# Altium schematic sheet 03-KSZ9567.SchDoc
size B; SheetNumber: 3; SheetTotal: 10
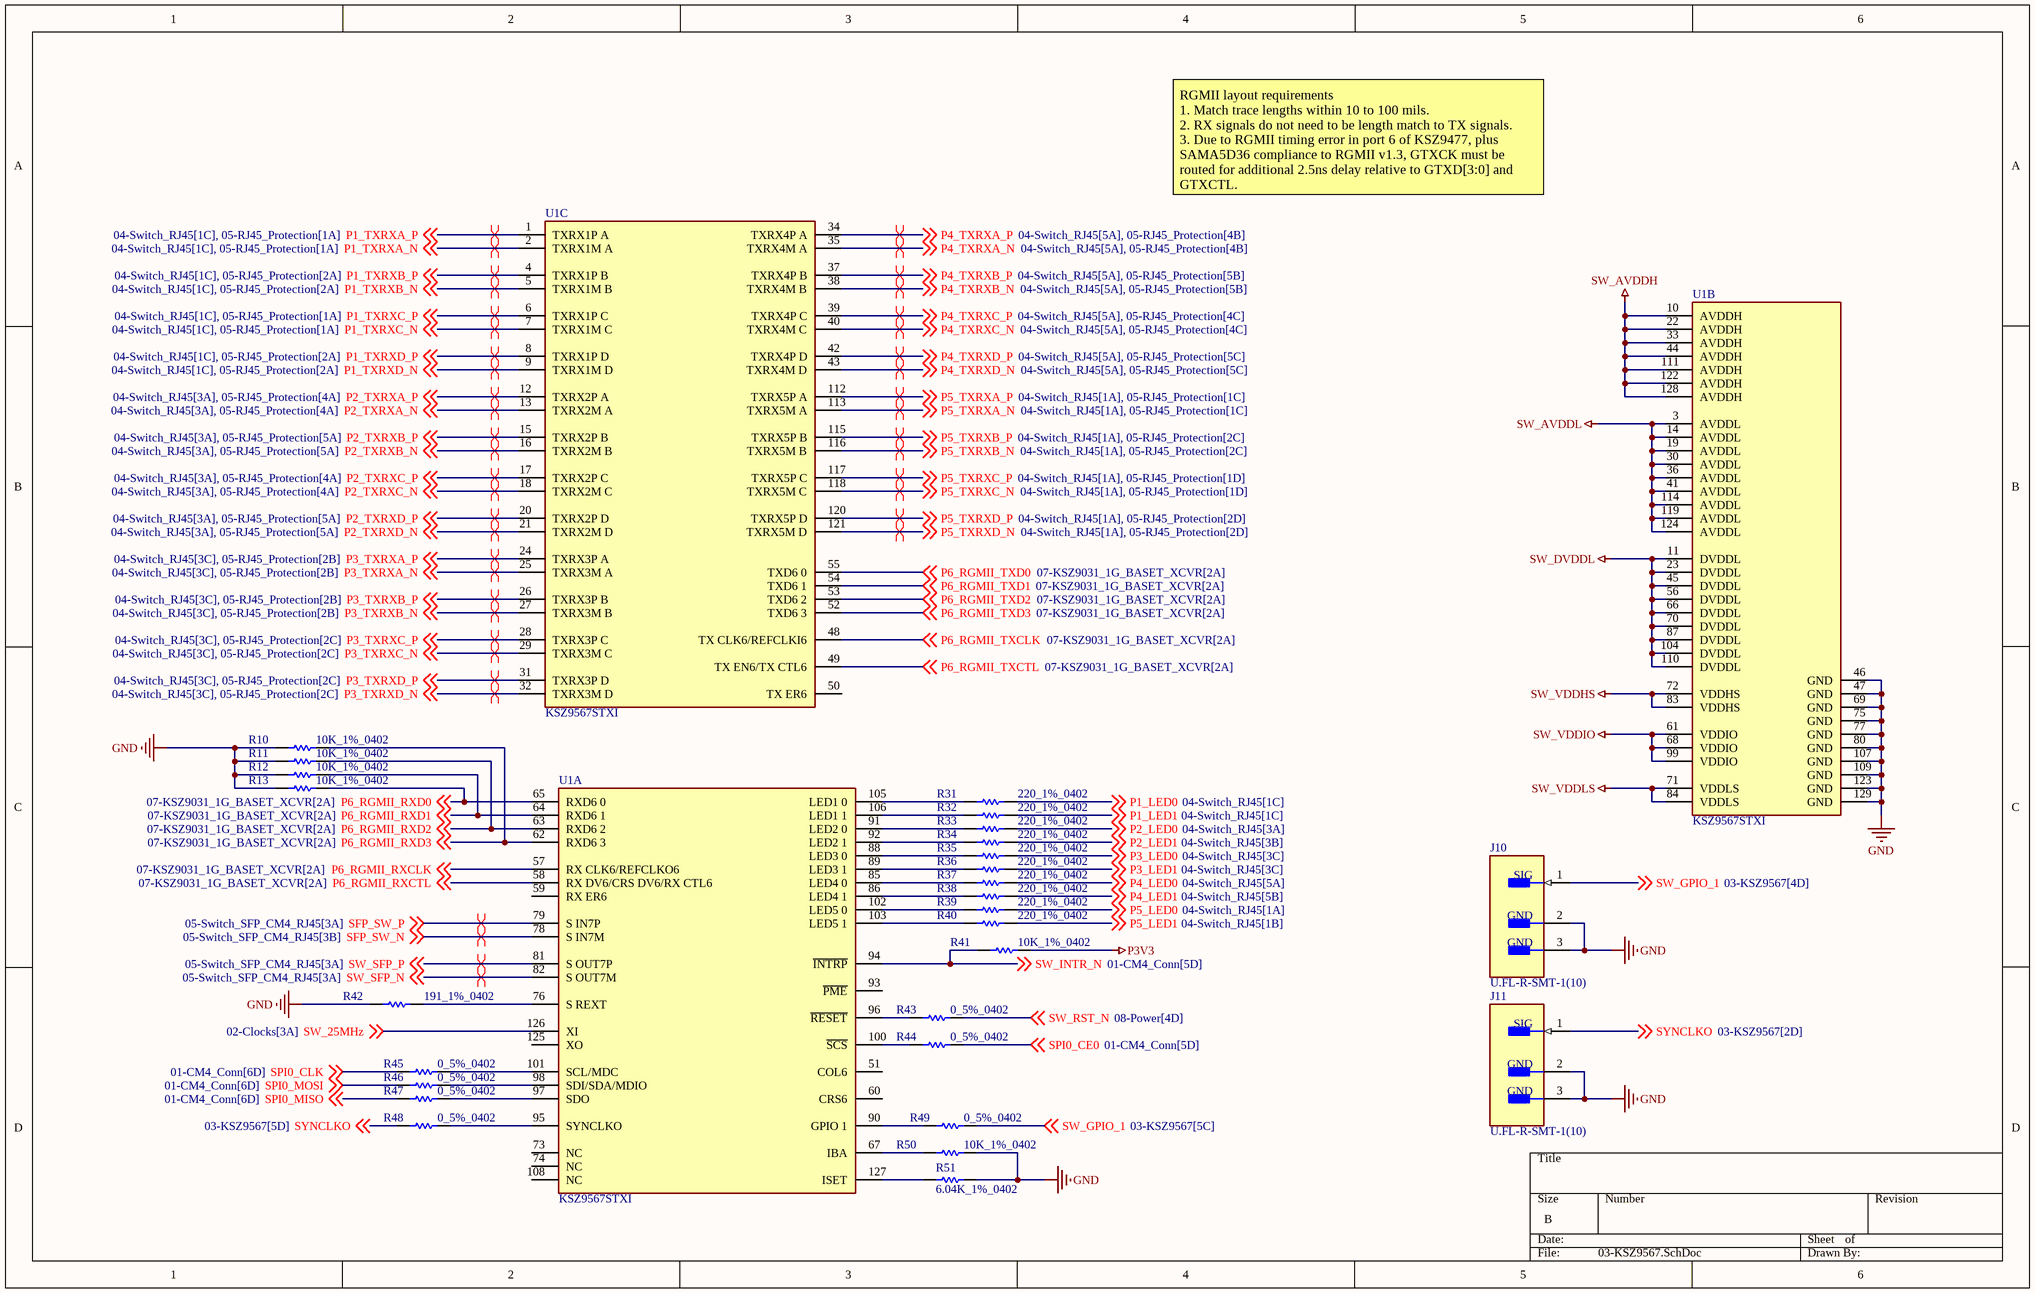
[diagram p0: 03-KSZ9567.SchDoc]

## Parts
J10  U.FL-R-SMT-1(10)  [FP-U_FL-R-SMT-1_10-MFG]
J11  U.FL-R-SMT-1(10)  [FP-U_FL-R-SMT-1_10-MFG]
R10  10K_1%_0402  [RESC1005X40X25NL10T10]
R11  10K_1%_0402  [RESC1005X40X25NL10T10]
R12  10K_1%_0402  [RESC1005X40X25NL10T10]
R13  10K_1%_0402  [RESC1005X40X25NL10T10]
R31  220_1%_0402  [RESC1005X40X25NL05T10]
R32  220_1%_0402  [RESC1005X40X25NL05T10]
R33  220_1%_0402  [RESC1005X40X25NL05T10]
R34  220_1%_0402  [RESC1005X40X25NL05T10]
R35  220_1%_0402  [RESC1005X40X25NL05T10]
R36  220_1%_0402  [RESC1005X40X25NL05T10]
R37  220_1%_0402  [RESC1005X40X25NL05T10]
R38  220_1%_0402  [RESC1005X40X25NL05T10]
R39  220_1%_0402  [RESC1005X40X25NL05T10]
R40  220_1%_0402  [RESC1005X40X25NL05T10]
R41  10K_1%_0402  [RESC1005X40X25NL10T10]
R42  191_1%_0402  [RESC1005X40X25LL10T10]
R43  0_5%_0402  [RESC1005X40X25NL05T10]
R44  0_5%_0402  [RESC1005X40X25NL05T10]
R45  0_5%_0402  [RESC1005X40X25NL05T10]
R46  0_5%_0402  [RESC1005X40X25NL05T10]
R47  0_5%_0402  [RESC1005X40X25NL05T10]
R48  0_5%_0402  [RESC1005X40X25NL05T10]
R49  0_5%_0402  [RESC1005X40X25NL05T10]
R50  10K_1%_0402  [RESC1005X40X25NL10T10]
R51  6.04K_1%_0402  [RESC1005X40X25NL10T10]
U1  KSZ9567STXI  [FP-C04-418-IPC_A]  (parts A,B,C of 3)

## Nets
GND: J10.2(GND) J10.3(GND) J11.2(GND) J11.3(GND) R10.1 R11.1 R12.1 R13.1 R42.1 R50.2 R51.2 U1.46(GND) U1.47(GND) U1.69(GND) U1.75(GND) U1.77(GND) U1.80(GND) U1.107(GND) U1.109(GND) U1.123(GND) U1.129(GND)
P3V3: R41.2
SW_AVDDH: U1.10(AVDDH) U1.22(AVDDH) U1.33(AVDDH) U1.44(AVDDH) U1.111(AVDDH) U1.122(AVDDH) U1.128(AVDDH)
SW_AVDDL: U1.3(AVDDL) U1.14(AVDDL) U1.19(AVDDL) U1.30(AVDDL) U1.36(AVDDL) U1.41(AVDDL) U1.114(AVDDL) U1.119(AVDDL) U1.124(AVDDL)
SW_DVDDL: U1.11(DVDDL) U1.23(DVDDL) U1.45(DVDDL) U1.56(DVDDL) U1.66(DVDDL) U1.70(DVDDL) U1.87(DVDDL) U1.104(DVDDL) U1.110(DVDDL)
SW_VDDHS: U1.72(VDDHS) U1.83(VDDHS)
SW_VDDIO: U1.61(VDDIO) U1.68(VDDIO) U1.99(VDDIO)
SW_VDDLS: U1.71(VDDLS) U1.84(VDDLS)
P1_LED0: R31.2 ; off-sheet P1_LED0
P1_LED1: R32.2 ; off-sheet P1_LED1
P1_TXRXA_N: U1.2(TXRX1M_A) ; off-sheet P1_TXRXA_N
P1_TXRXA_P: U1.1(TXRX1P_A) ; off-sheet P1_TXRXA_P
P1_TXRXB_N: U1.5(TXRX1M_B) ; off-sheet P1_TXRXB_N
P1_TXRXB_P: U1.4(TXRX1P_B) ; off-sheet P1_TXRXB_P
P1_TXRXC_N: U1.7(TXRX1M_C) ; off-sheet P1_TXRXC_N
P1_TXRXC_P: U1.6(TXRX1P_C) ; off-sheet P1_TXRXC_P
P1_TXRXD_N: U1.9(TXRX1M_D) ; off-sheet P1_TXRXD_N
P1_TXRXD_P: U1.8(TXRX1P_D) ; off-sheet P1_TXRXD_P
P2_LED0: R33.2 ; off-sheet P2_LED0
P2_LED1: R34.2 ; off-sheet P2_LED1
P2_TXRXA_N: U1.13(TXRX2M_A) ; off-sheet P2_TXRXA_N
P2_TXRXA_P: U1.12(TXRX2P_A) ; off-sheet P2_TXRXA_P
P2_TXRXB_N: U1.16(TXRX2M_B) ; off-sheet P2_TXRXB_N
P2_TXRXB_P: U1.15(TXRX2P_B) ; off-sheet P2_TXRXB_P
P2_TXRXC_N: U1.18(TXRX2M_C) ; off-sheet P2_TXRXC_N
P2_TXRXC_P: U1.17(TXRX2P_C) ; off-sheet P2_TXRXC_P
P2_TXRXD_N: U1.21(TXRX2M_D) ; off-sheet P2_TXRXD_N
P2_TXRXD_P: U1.20(TXRX2P_D) ; off-sheet P2_TXRXD_P
P3_LED0: R35.2 ; off-sheet P3_LED0
P3_LED1: R36.2 ; off-sheet P3_LED1
P3_TXRXA_N: U1.25(TXRX3M_A) ; off-sheet P3_TXRXA_N
P3_TXRXA_P: U1.24(TXRX3P_A) ; off-sheet P3_TXRXA_P
P3_TXRXB_N: U1.27(TXRX3M_B) ; off-sheet P3_TXRXB_N
P3_TXRXB_P: U1.26(TXRX3P_B) ; off-sheet P3_TXRXB_P
P3_TXRXC_N: U1.29(TXRX3M_C) ; off-sheet P3_TXRXC_N
P3_TXRXC_P: U1.28(TXRX3P_C) ; off-sheet P3_TXRXC_P
P3_TXRXD_N: U1.32(TXRX3M_D) ; off-sheet P3_TXRXD_N
P3_TXRXD_P: U1.31(TXRX3P_D) ; off-sheet P3_TXRXD_P
P4_LED0: R37.2 ; off-sheet P4_LED0
P4_LED1: R38.2 ; off-sheet P4_LED1
P4_TXRXA_N: U1.35(TXRX4M_A) ; off-sheet P4_TXRXA_N
P4_TXRXA_P: U1.34(TXRX4P_A) ; off-sheet P4_TXRXA_P
P4_TXRXB_N: U1.38(TXRX4M_B) ; off-sheet P4_TXRXB_N
P4_TXRXB_P: U1.37(TXRX4P_B) ; off-sheet P4_TXRXB_P
P4_TXRXC_N: U1.40(TXRX4M_C) ; off-sheet P4_TXRXC_N
P4_TXRXC_P: U1.39(TXRX4P_C) ; off-sheet P4_TXRXC_P
P4_TXRXD_N: U1.43(TXRX4M_D) ; off-sheet P4_TXRXD_N
P4_TXRXD_P: U1.42(TXRX4P_D) ; off-sheet P4_TXRXD_P
P5_LED0: R39.2 ; off-sheet P5_LED0
P5_LED1: R40.2 ; off-sheet P5_LED1
P5_TXRXA_N: U1.113(TXRX5M_A) ; off-sheet P5_TXRXA_N
P5_TXRXA_P: U1.112(TXRX5P_A) ; off-sheet P5_TXRXA_P
P5_TXRXB_N: U1.116(TXRX5M_B) ; off-sheet P5_TXRXB_N
P5_TXRXB_P: U1.115(TXRX5P_B) ; off-sheet P5_TXRXB_P
P5_TXRXC_N: U1.118(TXRX5M_C) ; off-sheet P5_TXRXC_N
P5_TXRXC_P: U1.117(TXRX5P_C) ; off-sheet P5_TXRXC_P
P5_TXRXD_N: U1.121(TXRX5M_D) ; off-sheet P5_TXRXD_N
P5_TXRXD_P: U1.120(TXRX5P_D) ; off-sheet P5_TXRXD_P
P6_RGMII_RXCLK: U1.57(RX_CLK6/REFCLKO6) ; off-sheet P6_RGMII_RXCLK
P6_RGMII_RXCTL: U1.58(RX_DV6/CRS_DV6/RX_CTL6) ; off-sheet P6_RGMII_RXCTL
P6_RGMII_RXD0: R13.2 U1.65(RXD6_0) ; off-sheet P6_RGMII_RXD0
P6_RGMII_RXD1: R12.2 U1.64(RXD6_1) ; off-sheet P6_RGMII_RXD1
P6_RGMII_RXD2: R11.2 U1.63(RXD6_2) ; off-sheet P6_RGMII_RXD2
P6_RGMII_RXD3: R10.2 U1.62(RXD6_3) ; off-sheet P6_RGMII_RXD3
P6_RGMII_TXCLK: U1.48(TX_CLK6/REFCLKI6) ; off-sheet P6_RGMII_TXCLK
P6_RGMII_TXCTL: U1.49(TX_EN6/TX_CTL6) ; off-sheet P6_RGMII_TXCTL
P6_RGMII_TXD0: U1.55(TXD6_0) ; off-sheet P6_RGMII_TXD0
P6_RGMII_TXD1: U1.54(TXD6_1) ; off-sheet P6_RGMII_TXD1
P6_RGMII_TXD2: U1.53(TXD6_2) ; off-sheet P6_RGMII_TXD2
P6_RGMII_TXD3: U1.52(TXD6_3) ; off-sheet P6_RGMII_TXD3
SFP_SW_N: U1.78(S_IN7M) ; off-sheet SFP_SW_N
SFP_SW_P: U1.79(S_IN7P) ; off-sheet SFP_SW_P
SPI0_CE0: R44.2 ; off-sheet SPI0_CE0
SPI0_CLK: R45.1 ; off-sheet SPI0_CLK
SPI0_MISO: R47.1 ; off-sheet SPI0_MISO
SPI0_MOSI: R46.1 ; off-sheet SPI0_MOSI
SW_25MHz: U1.126(XI) ; off-sheet SW_25MHz
SW_GPIO_1: J10.1(SIG) R49.2 ; off-sheet SW_GPIO_1
SW_INTR_N: R41.1 U1.94(~{INTRP}) ; off-sheet SW_INTR_N
SW_RST_N: R43.2 ; off-sheet SW_RST_N
SW_SFP_N: U1.82(S_OUT7M) ; off-sheet SW_SFP_N
SW_SFP_P: U1.81(S_OUT7P) ; off-sheet SW_SFP_P
SYNCLKO: J11.1(SIG) R48.1 ; off-sheet SYNCLKO
NetR31_1: R31.1 U1.105(LED1_0)
NetR32_1: R32.1 U1.106(LED1_1)
NetR33_1: R33.1 U1.91(LED2_0)
NetR34_1: R34.1 U1.92(LED2_1)
NetR35_1: R35.1 U1.88(LED3_0)
NetR36_1: R36.1 U1.89(LED3_1)
NetR37_1: R37.1 U1.85(LED4_0)
NetR38_1: R38.1 U1.86(LED4_1)
NetR39_1: R39.1 U1.102(LED5_0)
NetR40_1: R40.1 U1.103(LED5_1)
NetR42_2: R42.2 U1.76(S_REXT)
NetR43_1: R43.1 U1.96(~{RESET})
NetR44_1: R44.1 U1.100(~{SCS})
NetR45_2: R45.2 U1.101(SCL/MDC)
NetR46_2: R46.2 U1.98(SDI/SDA/MDIO)
NetR47_2: R47.2 U1.97(SDO)
NetR48_2: R48.2 U1.95(SYNCLKO)
NetR49_1: R49.1 U1.90(GPIO_1)
NetR50_1: R50.1 U1.67(IBA)
NetR51_1: R51.1 U1.127(ISET)

Not connected (* = marked no-connect by the designer): U1 50(TX_ER6) 51(COL6) 59(RX_ER6) 60(CRS6) 73(NC) 74(NC) 93(~{PME}) 108(NC) 125(XO)

## Layout directives
differential pair: P1_TXRXA_N, P1_TXRXA_P, P1_TXRXB_N, P1_TXRXB_P, P1_TXRXC_N, P1_TXRXC_P, P1_TXRXD_N, P1_TXRXD_P, P2_TXRXA_N, P2_TXRXA_P, P2_TXRXB_N, P2_TXRXB_P, P2_TXRXC_N, P2_TXRXC_P, P2_TXRXD_N, P2_TXRXD_P, P3_TXRXA_N, P3_TXRXA_P, P3_TXRXB_N, P3_TXRXB_P, P3_TXRXC_N, P3_TXRXC_P, P3_TXRXD_N, P3_TXRXD_P, P4_TXRXA_N, P4_TXRXA_P, P4_TXRXB_N, P4_TXRXB_P, P4_TXRXC_N, P4_TXRXC_P, P4_TXRXD_N, P4_TXRXD_P, P5_TXRXA_N, P5_TXRXA_P, P5_TXRXB_N, P5_TXRXB_P, P5_TXRXC_N, P5_TXRXC_P, P5_TXRXD_N, P5_TXRXD_P, SFP_SW_N, SFP_SW_P, SW_SFP_N, SW_SFP_P

## Notes on the sheet
- RGMII layout requirements
  1. Match trace lengths within 10 to 100 mils.
  2. RX signals do not need to be length match to TX signals.
  3. Due to RGMII timing error in port 6 of KSZ9477, plus SAMA5D36 compliance to RGMII v1.3, GTXCK must be routed for additional 2.5ns delay relative to GTXD[3:0] and GTXCTL.

## Library data of the parts
J10 J11 = CMP-2000-05152-3: CONN U.FL RCPT STR 50 OHM SMD; Max Frequency: 6GHz; Connector Type: Coaxial; Body Plating: Silver; Body Material: Bronze; Impedance: 50R; Dielectric Material: Polymer; Insulation Resistance: 500MR; Gender: Male; Packaging: Cut Tape; Length: 3mm; Package Quantity: 2500; Termination: Solder; Lead Free: Lead Free; Series: U.FL; Min Operating Temperature: -40°C; Fastening Type: Snap; Contact Material: Brass; Orientation: Straight; Wire/Cable Type: Coaxial; Frequency: 6GHz; Contact Plating: Gold; Depth: 3.1mm; Weight: 0.001764oz; Max Operating Temperature: 90°C; Radiation Hardening: No; REACH SVHC: No SVHC; Mount: Surface Mount; Housing Color: Beige
R10-R13 R41 R50 = CMP-2002-04694-1: Manufacturer: Bourns; Part Number: CR0402-FX-1002GLF
R31-R40 = CMP-2002-07959-1: Manufacturer: Yageo / Phycomp; Part Number: RC0402JR-07220RL
R42 = CMP-2002-04891-1: Manufacturer: Bourns; Part Number: CR0402-FX-1910GLF
R43-R49 = CMP-2002-06457-1: Manufacturer: Panasonic; Part Number: ERJ-U020R00X
R51 = CMP-2002-06319-1: Manufacturer: Multicomp; Part Number: MC00625W040216K04
U1 = CMP-06281-000207-1: IC ETHERNET SWITCH 7PORT 128TQFP; Interface: I2C; Max Operating Temperature: 85°C; Min Operating Temperature: -40°C; Packaging: Tray; RoHS Compliant: Yes